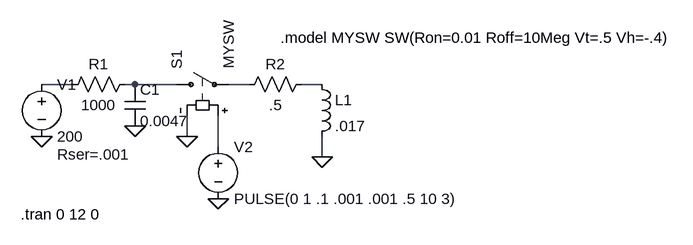
[diagram p0: schematic CL_simulation_1JULY2025.asc]
CL_simulation_1JULY2025.asc, the LTspice schematic file:
Version 4.1
SHEET 1 1004 680
WIRE 32 192 -16 192
WIRE 128 192 112 192
WIRE 192 192 128 192
WIRE 304 192 272 192
WIRE 416 192 384 192
WIRE 208 272 208 240
WIRE 256 288 256 240
WIRE 416 304 416 272
FLAG 128 256 0
FLAG 416 304 0
FLAG 208 272 0
FLAG -16 272 0
FLAG 256 368 0
SYMBOL cap 112 192 R0
SYMATTR InstName C1
SYMATTR Value 0.0047
SYMATTR SpiceLine Rser=.001
SYMBOL ind 400 176 R0
SYMATTR InstName L1
SYMATTR Value .017
SYMBOL sw 176 192 R270
SYMATTR InstName S1
SYMATTR Value MYSW
SYMBOL voltage -16 176 R0
WINDOW 123 0 0 Left 0
WINDOW 39 24 124 Left 2
SYMATTR SpiceLine Rser=.001
SYMATTR InstName V1
SYMATTR Value 200
SYMBOL res 128 176 R90
WINDOW 0 0 56 VBottom 2
WINDOW 3 32 56 VTop 2
SYMATTR InstName R1
SYMATTR Value 1000
SYMBOL voltage 256 272 R0
WINDOW 123 0 0 Left 0
WINDOW 39 0 0 Left 0
SYMATTR InstName V2
SYMATTR Value PULSE(0 1 .1 .001 .001 .5 10 3)
SYMBOL res 400 176 R90
WINDOW 0 0 56 VBottom 2
WINDOW 3 32 56 VTop 2
SYMATTR InstName R2
SYMATTR Value .5
TEXT 352 120 Left 2 !.model MYSW SW(Ron=0.01 Roff=10Meg Vt=.5 Vh=-.4)
TEXT -48 392 Left 2 !.tran 0 12 0

The netlist it stands for:
* CL_simulation_1JULY2025.asc
C1 N002 0 0.0047 Rser=.001
L1 N004 0 .017
S1 N002 N003 N005 0 MYSW
V1 N001 0 200 Rser=.001
R1 N002 N001 1000
V2 N005 0 PULSE(0 1 .1 .001 .001 .5 10 3)
R2 N004 N003 .5
.model MYSW SW(Ron=0.01 Roff=10Meg Vt=.5 Vh=-.4)
.tran 0 12 0
.backanno
.end